# Altium schematic sheet Sheet3.SchDoc: VIOB
size 420 x 297 mm; Date: 18/09/2021; ApprovedBy: PBaizan; CheckedBy: PBaizan; Author: PBaizan; CompanyName: IONOSENS; DrawnBy: PBaizan; Engineer: PBaizan; Organization: IONOSENS; DocumentNumber: 20210001002SCH; Revision: 01; SheetNumber: 03; SheetTotal: 03; SubTitle: VISIR Instrument Oscilloscope Board (Connectors); CAGE_CODE: 0002-21; DOC_NO_SCH_DWG: 210001002SCH; SCH_SCALE: None
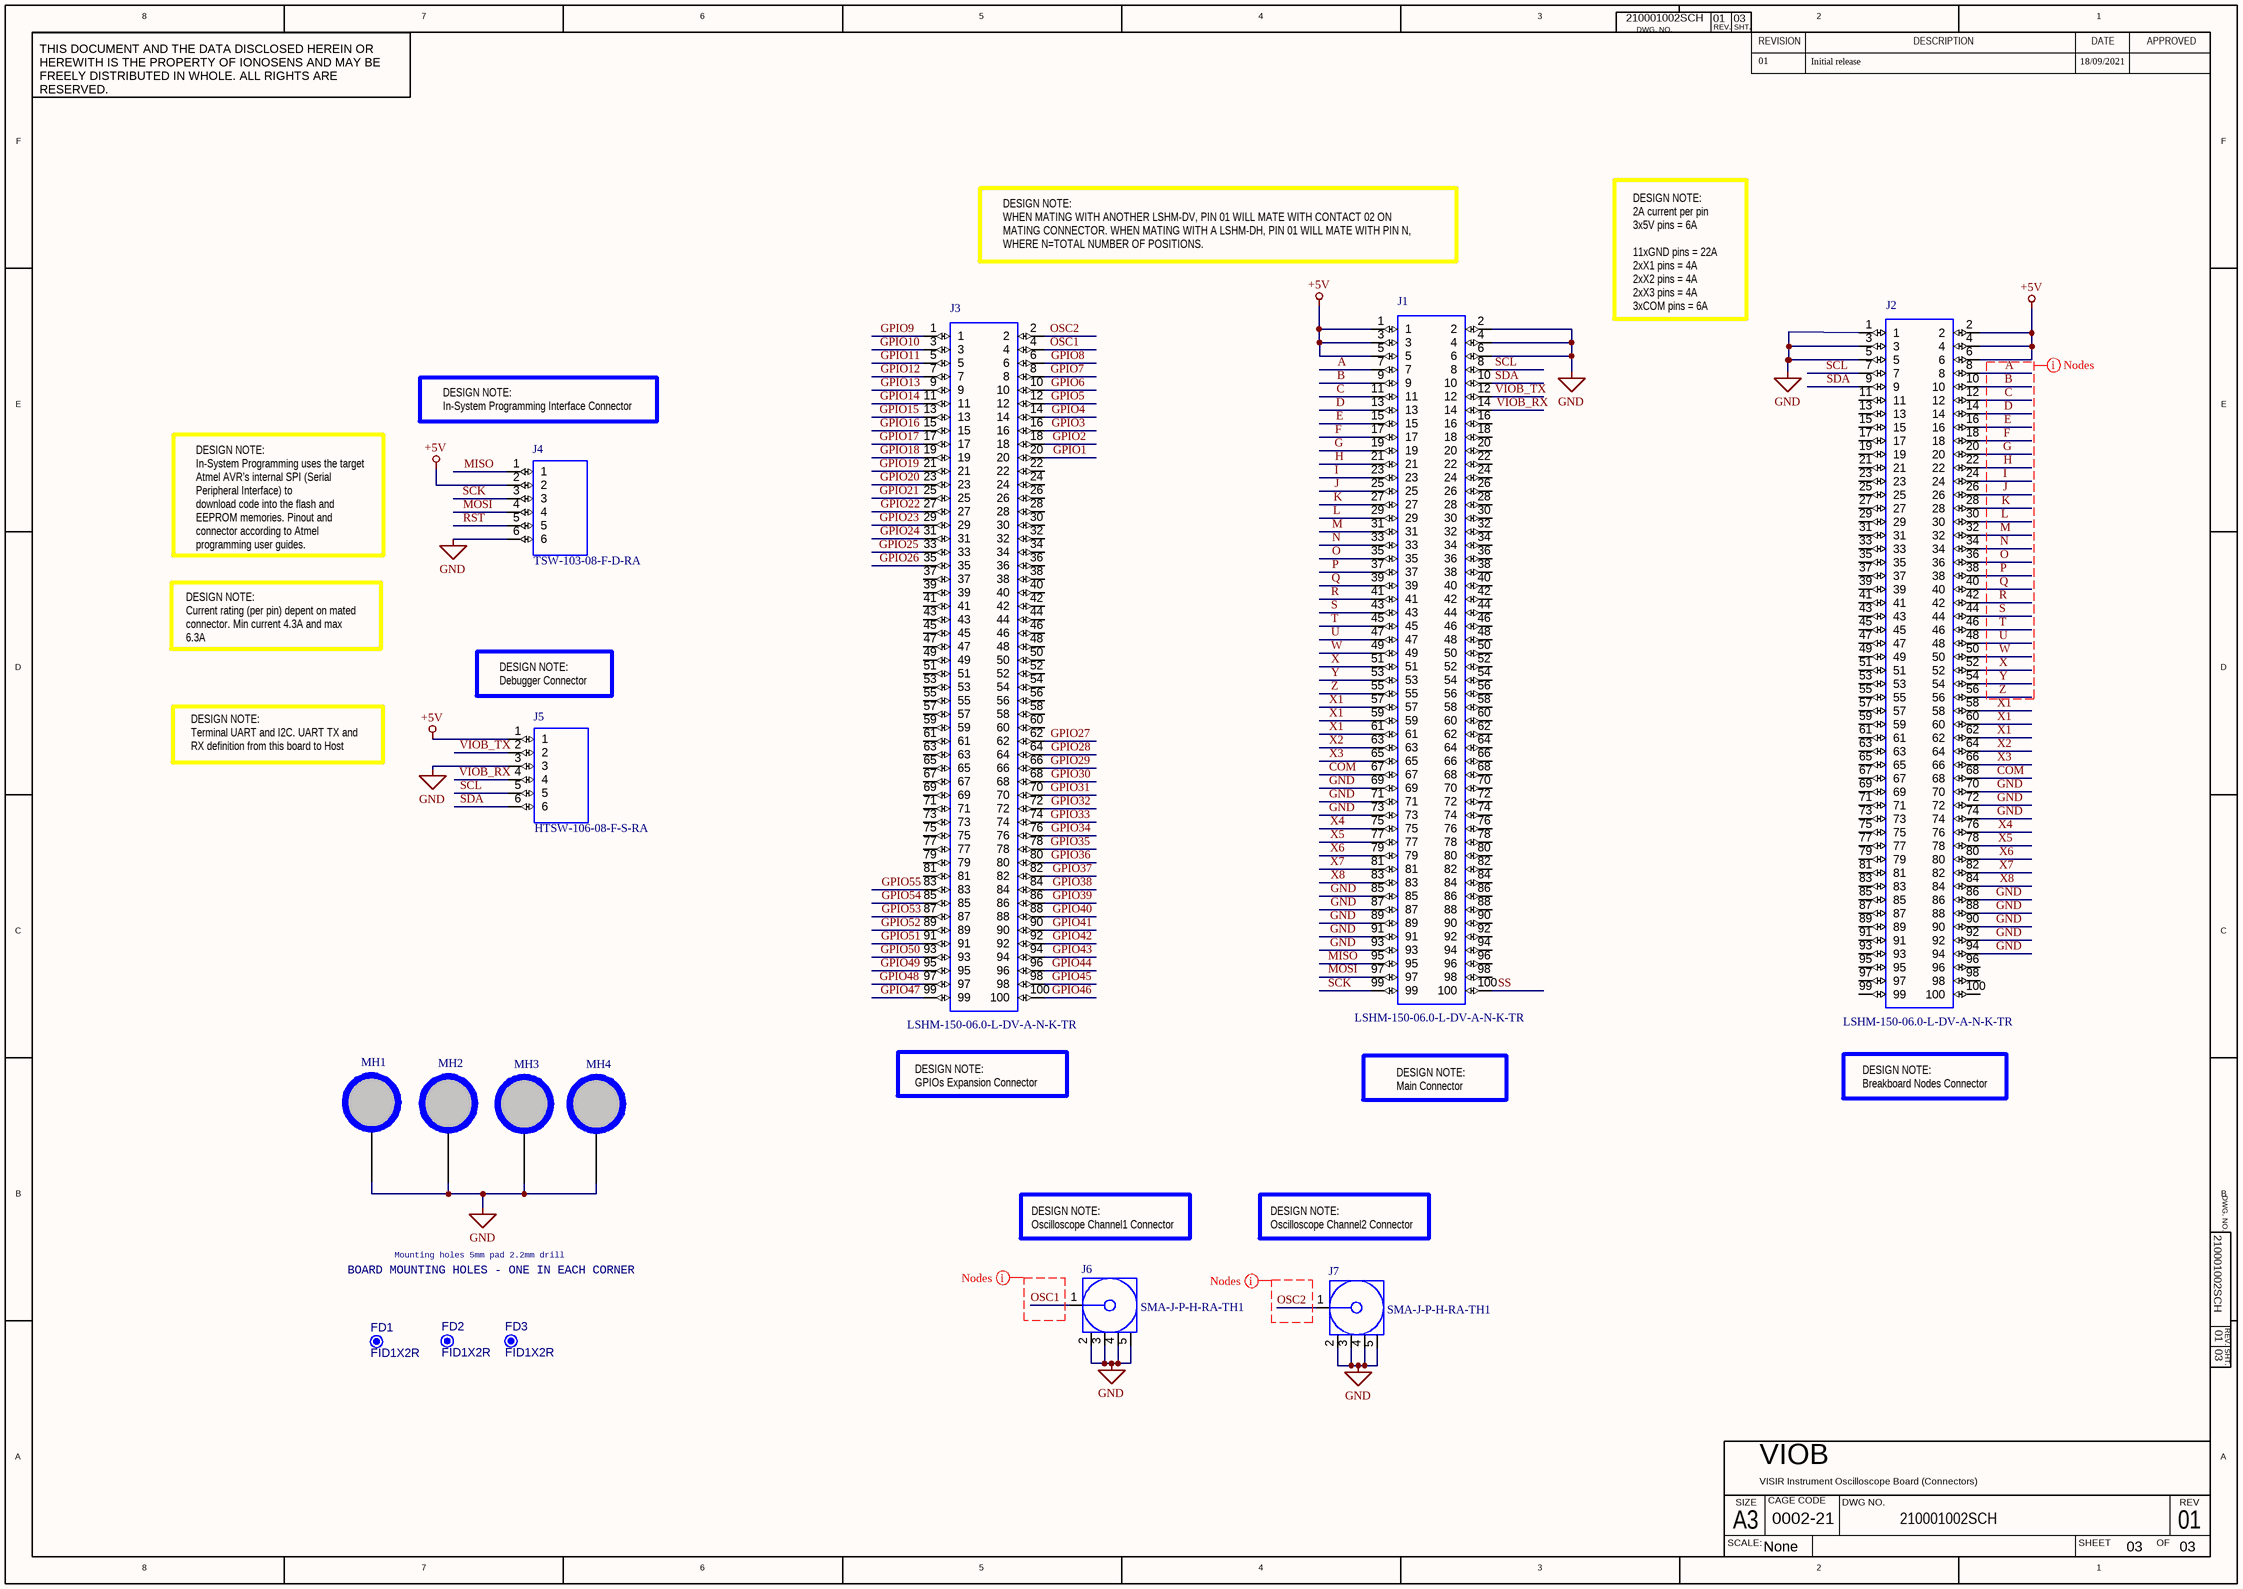
[diagram p0: Sheet3.SchDoc]

## Parts
FD1  FID1X2R  [FID1X2R]  (no BOM)
FD2  FID1X2R  [FID1X2R]  (no BOM)
FD3  FID1X2R  [FID1X2R]  (no BOM)
J1  LSHM-150-06.0-L-DV-A-N-K-TR  [LSHM_150_06_0_L_DV_A_N_K_TR]
J2  LSHM-150-06.0-L-DV-A-N-K-TR  [LSHM_150_06_0_L_DV_A_N_K_TR]
J3  LSHM-150-06.0-L-DV-A-N-K-TR  [LSHM_150_06_0_L_DV_A_N_K_TR]
J4  TSW-103-08-F-D-RA  [TSW-103-08-F-D-RA]
J5  HTSW-106-08-F-S-RA  [TSW-106-08-F-S-RA]
J6  SMA-J-P-H-RA-TH1  [SMA-J-P-H-RA-TH1]
J7  SMA-J-P-H-RA-TH1  [SMA-J-P-H-RA-TH1]
MH1  C500h220  [C500h220z368]  (value not drawn)
MH2  C500h220  [C500h220z368]  (value not drawn)
MH3  C500h220  [C500h220z368]  (value not drawn)
MH4  C500h220  [C500h220z368]  (value not drawn)

## Nets
+5V: J1.1 J1.3 J1.5 J2.2 J2.4 J2.6 J4.2 J5.1
GND: J1.2 J1.4 J1.6 J1.69 J1.71 J1.73 J1.85 J1.87 J1.89 J1.91 J1.93 J2.1 J2.3 J2.5 J2.70 J2.72 J2.74 J2.86 J2.88 J2.90 J2.92 J2.94 J4.6 J5.3 J6.2 J6.3 J6.4 J6.5 J7.2 J7.3 J7.4 J7.5 MH1.1 MH2.1 MH3.1 MH4.1
A: J1.7 J2.8
B: J1.9 J2.10
C: J1.11 J2.12
COM: J1.67 J2.68
D: J1.13 J2.14
E: J1.15 J2.16
F: J1.17 J2.18
G: J1.19 J2.20
GPIO1: J3.20
GPIO2: J3.18
GPIO3: J3.16
GPIO4: J3.14
GPIO5: J3.12
GPIO6: J3.10
GPIO7: J3.8
GPIO8: J3.6
GPIO9: J3.1
GPIO10: J3.3
GPIO11: J3.5
GPIO12: J3.7
GPIO13: J3.9
GPIO14: J3.11
GPIO15: J3.13
GPIO16: J3.15
GPIO17: J3.17
GPIO18: J3.19
GPIO19: J3.21
GPIO20: J3.23
GPIO21: J3.25
GPIO22: J3.27
GPIO23: J3.29
GPIO24: J3.31
GPIO25: J3.33
GPIO26: J3.35
GPIO27: J3.62
GPIO28: J3.64
GPIO29: J3.66
GPIO30: J3.68
GPIO31: J3.70
GPIO32: J3.72
GPIO33: J3.74
GPIO34: J3.76
GPIO35: J3.78
GPIO36: J3.80
GPIO37: J3.82
GPIO38: J3.84
GPIO39: J3.86
GPIO40: J3.88
GPIO41: J3.90
GPIO42: J3.92
GPIO43: J3.94
GPIO44: J3.96
GPIO45: J3.98
GPIO46: J3.100
GPIO47: J3.99
GPIO48: J3.97
GPIO49: J3.95
GPIO50: J3.93
GPIO51: J3.91
GPIO52: J3.89
GPIO53: J3.87
GPIO54: J3.85
GPIO55: J3.83
H: J1.21 J2.22
I: J1.23 J2.24
J: J1.25 J2.26
K: J1.27 J2.28
L: J1.29 J2.30
M: J1.31 J2.32
MISO: J1.95 J4.1
MOSI: J1.97 J4.4
N: J1.33 J2.34
O: J1.35 J2.36
OSC1: J3.4 J6.1
OSC2: J3.2 J7.1
P: J1.37 J2.38
Q: J1.39 J2.40
R: J1.41 J2.42
RST: J4.5
S: J1.43 J2.44
SCK: J1.99 J4.3
SCL: J1.8 J2.7 J5.5
SDA: J1.10 J2.9 J5.6
SS: J1.100
T: J1.45 J2.46
U: J1.47 J2.48
VIOB_RX: J1.14 J5.4
VIOB_TX: J1.12 J5.2
W: J1.49 J2.50
X: J1.51 J2.52
X1: J1.57 J1.59 J1.61 J2.58 J2.60 J2.62
X2: J1.63 J2.64
X3: J1.65 J2.66
X4: J1.75 J2.76
X5: J1.77 J2.78
X6: J1.79 J2.80
X7: J1.81 J2.82
X8: J1.83 J2.84
Y: J1.53 J2.54
Z: J1.55 J2.56

Not connected (* = marked no-connect by the designer): J1 16 18 20 22 24 26 28 30 32 34 36 38 40 42 44 46 48 50 52 54 56 58 60 62 64 66 68 70 72 74 76 78 80 82 84 86 88 90 92 94 96 98; J2 11 13 15 17 19 21 23 25 27 29 31 33 35 37 39 41 43 45 47 49 51 53 55 57 59 61 63 65 67 69 71 73 75 77 79 81 83 85 87 89 91 93 95 96 97 98 99 100; J3 22 24 26 28 30 32 34 36 37 38 39 40 41 42 43 44 45 46 47 48 49 50 51 52 53 54 55 56 57 58 59 60 61 63 65 67 69 71 73 75 77 79 81

## Layout directives
net class Nodes: A, B, C, D, E, F, G, H, I, J, K, L, M, N, O, P, Q, R, S, T, U, W, X, Y, Z
mark named Nodes: OSC1, OSC2

## Notes on the sheet
- 01
- Initial release
- 18/09/2021
- DESIGN NOTE:
  WHEN MATING WITH ANOTHER LSHM-DV, PIN 01 WILL MATE WITH CONTACT 02 ON
  MATING CONNECTOR. WHEN MATING WITH A LSHM-DH, PIN 01 WILL MATE WITH PIN N,
  WHERE N=TOTAL NUMBER OF POSITIONS.
- DESIGN NOTE:
  2A current per pin
  3x5V pins = 6A
  11xGND pins = 22A
  2xX1 pins = 4A
  2xX2 pins = 4A
  2xX3 pins = 4A
  3xCOM pins = 6A
- DESIGN NOTE:
  In-System Programming Interface Connector
- DESIGN NOTE:
  In-System Programming uses the target Atmel AVR’s internal SPI (Serial Peripheral Interface) to
  download code into the flash and EEPROM memories. Pinout and connector according to Atmel programming user guides.
- DESIGN NOTE:
  Current rating (per pin) depent on mated connector. Min current 4.3A and max 6.3A
- (near J5) DESIGN NOTE:
  Debugger Connector
- DESIGN NOTE:
  Terminal UART and I2C. UART TX and RX definition from this board to Host
- DESIGN NOTE:
  GPIOs Expansion Connector
- DESIGN NOTE:
  Main Connector
- DESIGN NOTE:
  Breakboard Nodes Connector
- BOARD MOUNTING HOLES - ONE IN EACH CORNER
- Mounting holes 5mm pad 2.2mm drill
- DESIGN NOTE:
  Oscilloscope Channel1 Connector
- DESIGN NOTE:
  Oscilloscope Channel2 Connector
- 8
- 7
- 6
- 5
- 4
- 3
- DWG. NO.
- REV.
- SHT.
- REVISION
- 2
- DESCRIPTION
- DATE
- 1
- APPROVED
- THIS DOCUMENT AND THE DATA DISCLOSED HEREIN OR HEREWITH IS THE PROPERTY OF IONOSENS AND MAY BE FREELY DISTRIBUTED IN WHOLE. ALL RIGHTS ARE RESERVED.
- F
- E
- D
- C
- B
- A
- SCALE:
- A3
- SIZE
- CAGE CODE
- DWG NO.
- SHEET
- OF
- REV

## Library data of the parts
FD1-FD3 = CMP-00028-00005-2: Fiducial - Round 1x2mm; Pins: 0
J1-J3 = J01-001-01-00001-2: Conn Socket and Terminal Strip HDR/SKT 100 POS 0.5mm Solder ST SMD T/R; Manufacturer: Samtec; Gender: HERMAPHRODITIC; Pitch: 500 µm; Contact Plating: Gold; Case/Package: SMD; Max Operating Temperature: 125°C; Number of Rows: 2; RoHS Compliant: Yes; Housing Color: Black; Mounting Technology: SMD; Pins: 100; Termination: Solder; Orientation: Straight; Depth: 4.98 mm; Length: 29.7 mm; Contact Material: Bronze; Housing Material: Polymer; Min Operating Temperature: -55°C; Manufacturer P/N: LSHM-150-06.0-L-DV-A-N-K-TR
J4 = J01-001-01-00003-2: 6 Vias Pin Header 2.54mm, Right Angle; Manufacturer: Samtec; Gender: Male; Orientation: Straight; Mounting Technology: Through Hole; Contact Material: Bronze; Housing Material: Polyester; Pitch: 2.54mm; Housing Color: Black; Termination: Solder; Min Operating Temperature: -55°C; Pins: 6; Depth: 4.87 mm; RoHS Compliant: Yes; Manufacturer P/N: TSW-103-08-F-D-RA; Length: 7.62 mm; Contact Plating: Gold; Number of Rows: 2; Max Operating Temperature: 125°C; Case/Package: Through Hole
J5 = J01-001-01-00005-2: 6 Vias Pin Header 2.54mm, Right Angle, 1 Row; Manufacturer: Samtec; Gender: Male; Mounting Technology: Through Hole; RoHS Compliant: Yes; Contact Plating: Gold; Max Operating Temperature: 125°C; Pins: 6; Housing Material: Polyester; Case/Package: Through Hole; Pitch: 2.54mm; Contact Material: Bronze; Length: 7.62 mm; Termination: Solder; Number of Rows: 2; Manufacturer P/N: HTSW-106-08-F-S-RA; Depth: 4.87 mm; Orientation: Straight; Min Operating Temperature: -55°C; Housing Color: Black
J6 J7 = J01-001-01-00009-2: Conn SMA RCP 0Hz to 18GHz 50Ohm Solder RA Thru-Hole Gold; Manufacturer: Samtec; Pitch: 0; Gender: Female; Contact Material: Copper, Gold; RoHS Compliant: Yes; Termination: solder; Min Operating Temperature: -65°C; Number of Rows: 1; Manufacturer P/N: SMA-J-P-H-RA-TH1; Housing Material: Copper, Gold; Mounting Technology: TH; Case/Package: TH; Orientation: Right angle; Length: 15.1mm; Depth: 7mm; Housing Color: Gold; Max Operating Temperature: 125°C; Pins: 5; Contact Plating: Gold
MH1-MH4 = CMP-00028-00007-2: hole 5mm pad drill 2.2; Manufacturer: Ionosens; Manufacturer P/N: H5D22; Mounting Technology: Pad; RoHS Compliant: yes; Case/Package: Pad; Min Operating Temperature: 125°C; Pins: 1; Max Operating Temperature: -40°C